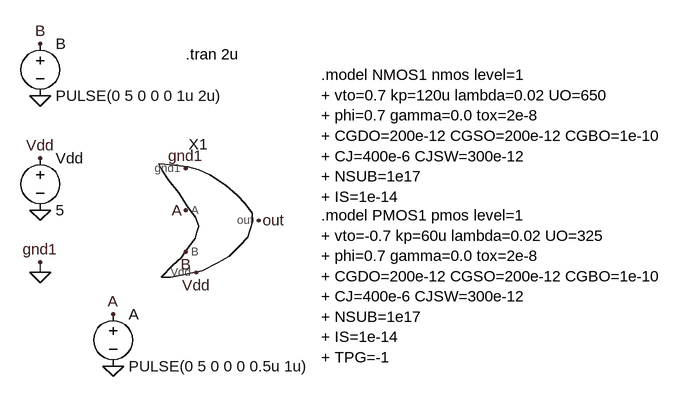
[diagram p0: schematic Draft12.asc]
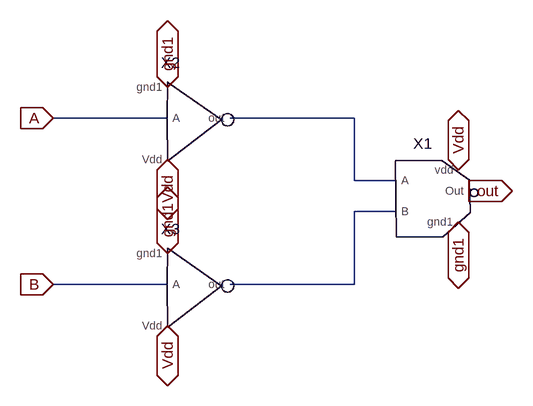
[diagram p1: sub-circuit orrrrr.asc]
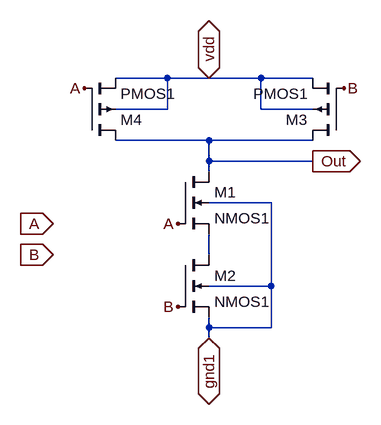
[diagram p2: sub-circuit nand.asc]
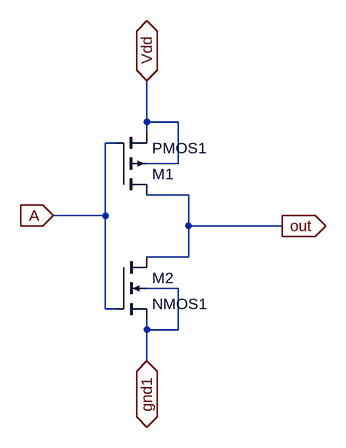
[diagram p3: sub-circuit not.asc]
Draft12.asc, the LTspice schematic file:
Version 4.1
SHEET 1 908 680
WIRE -80 240 -80 224
FLAG -80 144 0
FLAG 32 384 0
FLAG -80 -32 0
FLAG -80 64 Vdd
FLAG -80 -112 B
FLAG 32 304 A
FLAG -80 240 0
FLAG -80 224 gnd1
FLAG 144 144 A
FLAG 144 208 B
FLAG 160 240 Vdd
FLAG 256 160 out
FLAG 144 80 gnd1
SYMBOL ORRRRR 192 160 R0
SYMATTR InstName X1
SYMBOL voltage -80 48 R0
WINDOW 123 0 0 Left 0
WINDOW 39 0 0 Left 0
SYMATTR InstName Vdd
SYMATTR Value 5
SYMBOL voltage 32 288 R0
WINDOW 123 0 0 Left 0
WINDOW 39 0 0 Left 0
SYMATTR InstName A
SYMATTR Value PULSE(0 5 0 0 0 0.5u 1u)
SYMBOL voltage -80 -128 R0
WINDOW 123 0 0 Left 0
WINDOW 39 0 0 Left 0
SYMATTR InstName B
SYMATTR Value PULSE(0 5 0 0 0 1u 2u)
TEXT 352 -64 Left 2 !.model NMOS1 nmos level=1\n+ vto=0.7 kp=120u lambda=0.02 UO=650\n+ phi=0.7 gamma=0.0 tox=2e-8\n+ CGDO=200e-12 CGSO=200e-12 CGBO=1e-10\n+ CJ=400e-6 CJSW=300e-12\n+ NSUB=1e17\n+ IS=1e-14
TEXT 352 152 Left 2 !.model PMOS1 pmos level=1\n+ vto=-0.7 kp=60u lambda=0.02 UO=325\n+ phi=0.7 gamma=0.0 tox=2e-8\n+ CGDO=200e-12 CGSO=200e-12 CGBO=1e-10\n+ CJ=400e-6 CJSW=300e-12\n+ NSUB=1e17\n+ IS=1e-14\n+ TPG=-1
TEXT 144 -96 Left 2 !.tran 2u

orrrrr.asc, the sub-circuit schematic file:
Version 4.1
SHEET 1 880 680
WIRE 16 160 -160 160
WIRE 304 160 112 160
WIRE 304 256 304 160
WIRE 368 256 304 256
WIRE 368 304 304 304
WIRE 16 416 -160 416
WIRE 304 416 304 304
WIRE 304 416 112 416
FLAG -160 160 A
IOPIN -160 160 In
FLAG -160 416 B
IOPIN -160 416 In
FLAG 16 368 gnd1
IOPIN 16 368 BiDir
FLAG 16 480 Vdd
IOPIN 16 480 BiDir
FLAG 464 240 Vdd
IOPIN 464 240 BiDir
FLAG 16 224 Vdd
IOPIN 16 224 BiDir
FLAG 464 320 gnd1
IOPIN 464 320 BiDir
FLAG 16 112 gnd1
IOPIN 16 112 BiDir
FLAG 480 272 out
IOPIN 480 272 Out
SYMBOL NAND 416 288 R0
SYMATTR InstName X1
SYMBOL NOT 48 160 R0
SYMATTR InstName X2
SYMBOL NOT 48 416 R0
SYMATTR InstName X3

nand.asc, the sub-circuit schematic file:
Version 4.1
SHEET 1 880 680
WIRE 176 0 96 0
WIRE 240 0 176 0
WIRE 320 0 240 0
WIRE 400 0 320 0
WIRE 176 48 176 0
WIRE 176 48 96 48
WIRE 320 48 320 0
WIRE 400 48 320 48
WIRE 240 96 96 96
WIRE 400 96 240 96
WIRE 240 128 240 96
WIRE 400 128 240 128
WIRE 240 144 240 128
WIRE 336 192 240 192
WIRE 240 272 240 240
WIRE 336 320 336 192
WIRE 336 320 240 320
WIRE 240 384 240 368
WIRE 336 384 336 320
WIRE 336 384 240 384
WIRE 240 400 240 384
FLAG 0 224 A
IOPIN 0 224 In
FLAG 0 272 B
IOPIN 0 272 In
FLAG 400 128 Out
IOPIN 400 128 Out
FLAG 240 400 gnd1
IOPIN 240 400 BiDir
FLAG 240 0 vdd
IOPIN 240 0 BiDir
FLAG 48 16 A
FLAG 192 224 A
FLAG 192 352 B
FLAG 448 16 B
SYMBOL nmos4 192 144 R0
SYMATTR InstName M1
SYMATTR Value2 l=1u w=2u
SYMATTR Value NMOS1
SYMBOL nmos4 192 272 R0
SYMATTR InstName M2
SYMATTR Value2 l=1u w=2u
SYMATTR Value NMOS1
SYMBOL pmos4 448 96 R180
SYMATTR InstName M3
SYMATTR Value2 l=1u w=2u
SYMATTR Value PMOS1
SYMBOL pmos4 48 96 M180
SYMATTR InstName M4
SYMATTR Value2 l=1u w=2u
SYMATTR Value PMOS1

not.asc, the sub-circuit schematic file:
Version 4.1
SHEET 1 880 680
WIRE 256 64 256 0
WIRE 304 64 256 64
WIRE 256 80 256 64
WIRE 208 96 192 96
WIRE 304 128 304 64
WIRE 304 128 256 128
WIRE 320 176 256 176
WIRE 192 208 192 96
WIRE 192 208 112 208
WIRE 320 224 320 176
WIRE 464 224 320 224
WIRE 320 272 320 224
WIRE 320 272 256 272
WIRE 304 320 256 320
WIRE 192 352 192 208
WIRE 208 352 192 352
WIRE 256 384 256 368
WIRE 304 384 304 320
WIRE 304 384 256 384
WIRE 256 432 256 384
FLAG 256 432 gnd1
IOPIN 256 432 BiDir
FLAG 256 0 Vdd
IOPIN 256 0 BiDir
FLAG 464 224 out
IOPIN 464 224 Out
FLAG 112 208 A
IOPIN 112 208 In
SYMBOL pmos4 208 176 M180
SYMATTR InstName M1
SYMATTR Value2 l=1u w=2u
SYMATTR Value PMOS1
SYMBOL nmos4 208 272 R0
SYMATTR InstName M2
SYMATTR Value2 l=1u w=2u
SYMATTR Value NMOS1

The netlist it stands for:
* Draft12.asc
X§X1 A B 0 out Vdd orrrrr
Vdd Vdd 0 5
V§A A 0 PULSE(0 5 0 0 0 0.5u 1u)
V§B B 0 PULSE(0 5 0 0 0 1u 2u)

* block symbol definitions
.subckt orrrrr A B gnd1 out Vdd
X§X1 N001 N002 gnd1 out Vdd nand
X§X2 A gnd1 N001 Vdd not
X§X3 B gnd1 N002 Vdd not
.ends orrrrr

.subckt nand A B gnd1 Out vdd
M1 Out A N001 gnd1 NMOS1 l=1u w=2u
M2 N001 B gnd1 gnd1 NMOS1 l=1u w=2u
M3 Out B vdd vdd PMOS1 l=1u w=2u
M4 Out A vdd vdd PMOS1 l=1u w=2u
.ends nand

.subckt not A gnd1 out Vdd
M1 out A Vdd Vdd PMOS1 l=1u w=2u
M2 out A gnd1 gnd1 NMOS1 l=1u w=2u
.ends not

.model NMOS NMOS
.model PMOS PMOS
.lib standard.mos
.model NMOS1 nmos level=1
+ vto=0.7 kp=120u lambda=0.02 UO=650
+ phi=0.7 gamma=0.0 tox=2e-8
+ CGDO=200e-12 CGSO=200e-12 CGBO=1e-10
+ CJ=400e-6 CJSW=300e-12
+ NSUB=1e17
+ IS=1e-14
.model PMOS1 pmos level=1
+ vto=-0.7 kp=60u lambda=0.02 UO=325
+ phi=0.7 gamma=0.0 tox=2e-8
+ CGDO=200e-12 CGSO=200e-12 CGBO=1e-10
+ CJ=400e-6 CJSW=300e-12
+ NSUB=1e17
+ IS=1e-14
+ TPG=-1
.tran 2u
.backanno
.end